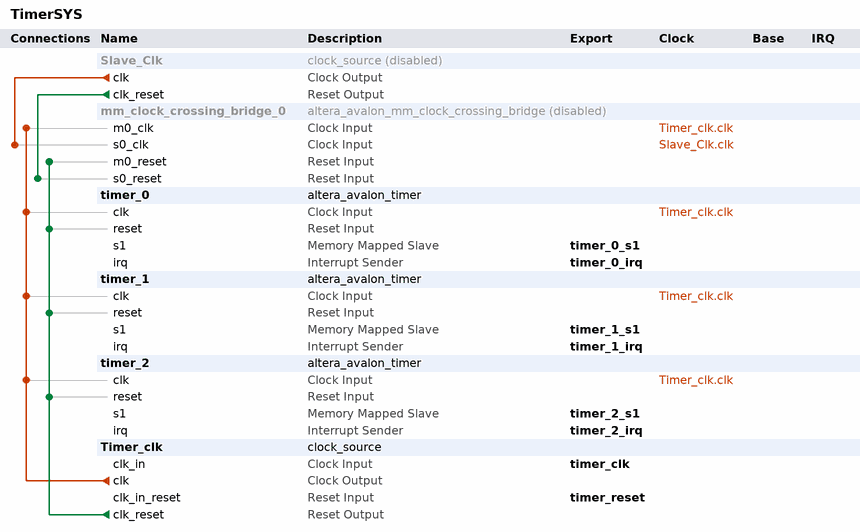
[diagram p0: system contents]
# Platform Designer (Qsys) system TimerSYS, MAX 10 10M50DAF484I7G
# Parameters at their usual value, and those the tool derives, are not listed.
package require -exact qsys 18.1
create_system TimerSYS
set_project_property DEVICE_FAMILY {MAX 10}
set_project_property DEVICE 10M50DAF484I7G

add_instance Slave_Clk clock_source 18.1
set_instance_property Slave_Clk ENABLED false
set_instance_parameter_value Slave_Clk clockFrequency 50000000

add_instance mm_clock_crossing_bridge_0 altera_avalon_mm_clock_crossing_bridge 18.1
set_instance_property mm_clock_crossing_bridge_0 ENABLED false
set_instance_parameter_value mm_clock_crossing_bridge_0 ADDRESS_WIDTH 10
set_instance_parameter_value mm_clock_crossing_bridge_0 COMMAND_FIFO_DEPTH 4
set_instance_parameter_value mm_clock_crossing_bridge_0 DATA_WIDTH 32
set_instance_parameter_value mm_clock_crossing_bridge_0 MASTER_SYNC_DEPTH 2
set_instance_parameter_value mm_clock_crossing_bridge_0 MAX_BURST_SIZE 1
set_instance_parameter_value mm_clock_crossing_bridge_0 RESPONSE_FIFO_DEPTH 4
set_instance_parameter_value mm_clock_crossing_bridge_0 SLAVE_SYNC_DEPTH 2
set_instance_parameter_value mm_clock_crossing_bridge_0 USE_AUTO_ADDRESS_WIDTH 1

add_instance timer_0 altera_avalon_timer 18.1
set_instance_parameter_value timer_0 period 1
set_instance_parameter_value timer_0 periodUnits MSEC

add_instance timer_1 altera_avalon_timer 18.1
set_instance_parameter_value timer_1 period 1
set_instance_parameter_value timer_1 periodUnits MSEC

add_instance timer_2 altera_avalon_timer 18.1
set_instance_parameter_value timer_2 period 1
set_instance_parameter_value timer_2 periodUnits MSEC

add_instance Timer_clk clock_source 18.1
set_instance_parameter_value Timer_clk clockFrequency 50000000

# connections
add_connection Slave_Clk.clk mm_clock_crossing_bridge_0.s0_clk clock
add_connection Timer_clk.clk mm_clock_crossing_bridge_0.m0_clk clock
add_connection Timer_clk.clk timer_0.clk clock
add_connection Timer_clk.clk timer_1.clk clock
add_connection Timer_clk.clk timer_2.clk clock
add_connection Slave_Clk.clk_reset mm_clock_crossing_bridge_0.s0_reset reset
add_connection Timer_clk.clk_reset mm_clock_crossing_bridge_0.m0_reset reset
add_connection Timer_clk.clk_reset timer_0.reset reset
add_connection Timer_clk.clk_reset timer_1.reset reset
add_connection Timer_clk.clk_reset timer_2.reset reset

# exported interfaces
add_interface timer_0_irq interrupt sender
set_interface_property timer_0_irq EXPORT_OF timer_0.irq
add_interface timer_0_s1 avalon slave
set_interface_property timer_0_s1 EXPORT_OF timer_0.s1
add_interface timer_1_irq interrupt sender
set_interface_property timer_1_irq EXPORT_OF timer_1.irq
add_interface timer_1_s1 avalon slave
set_interface_property timer_1_s1 EXPORT_OF timer_1.s1
add_interface timer_2_irq interrupt sender
set_interface_property timer_2_irq EXPORT_OF timer_2.irq
add_interface timer_2_s1 avalon slave
set_interface_property timer_2_s1 EXPORT_OF timer_2.s1
add_interface timer_clk clock sink
set_interface_property timer_clk EXPORT_OF Timer_clk.clk_in
add_interface timer_reset reset sink
set_interface_property timer_reset EXPORT_OF Timer_clk.clk_in_reset

set_interconnect_requirement {$system} qsys_mm.clockCrossingAdapter HANDSHAKE
set_interconnect_requirement {$system} qsys_mm.enableEccProtection FALSE
set_interconnect_requirement {$system} qsys_mm.insertDefaultSlave FALSE
set_interconnect_requirement {$system} qsys_mm.maxAdditionalLatency 1

save_system TimerSYS.qsys
